# EAGLE design NSL_CylonIV (EAGLE 5.11)

## Sheet 1 of 4
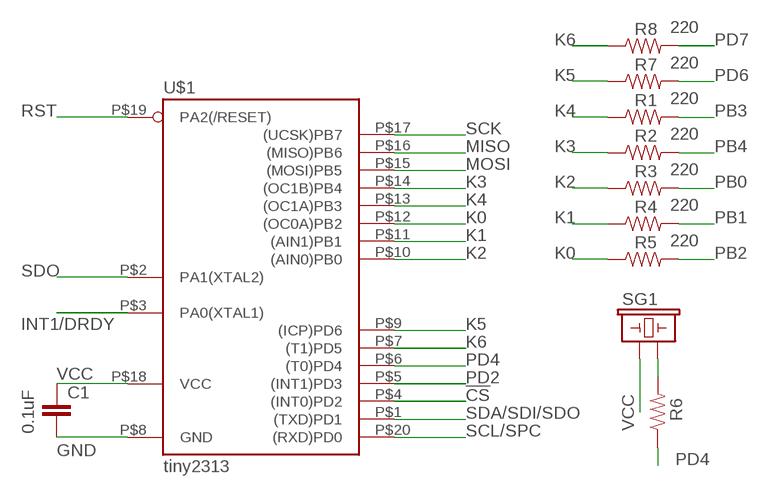
[diagram p0: schematic, sheet 1]

### Parts
C1  0.1uF  CAP0603-CAP  [0603-CAP]
R1  220  RESISTOR  [0805]
R2  220  RESISTOR  [0805]
R3  220  RESISTOR  [0805]
R4  220  RESISTOR  [0805]
R5  220  RESISTOR  [0805]
R6  RESISTOR1206  [1206]
R7  220  RESISTOR  [0805]
R8  220  RESISTOR  [0805]
SG1  BUZZERSMD2  [BUZZER-CCV]
U$1  tiny2313  TINY2313-*M*  [MLF20]

### Nets
!CS: U$1.P$4((INT0)PD2) ; also sheet 4
GND: C1.2 U$1.P$8(GND) ; also sheet 2,4
INT1/DRDY: U$1.P$3(PA0(XTAL1)) ; also sheet 4
K0 [LED]: R5.1 U$1.P$12((OC0A)PB2)
K1 [LED]: R4.1 U$1.P$11((AIN1)PB1)
K2 [LED]: R3.1 U$1.P$10((AIN0)PB0)
K3 [LED]: R2.1 U$1.P$14((OC1B)PB4)
K4 [LED]: R1.1 U$1.P$13((OC1A)PB3)
K5: R7.1 U$1.P$9((ICP)PD6)
K6: R8.1 U$1.P$7((T1)PD5)
MISO: U$1.P$16((MISO)PB6) ; also sheet 2
MOSI: U$1.P$15((MOSI)PB5) ; also sheet 2
N$4: R6.2 SG1.-
PB0: R3.2 ; also sheet 3
PB1: R4.2 ; also sheet 3
PB2 [LED]: R5.2 ; also sheet 3
PB3: R1.2 ; also sheet 3
PB4: R2.2 ; also sheet 3
PD2: U$1.P$5((INT1)PD3) ; also sheet 2
PD4: R6.1 U$1.P$6((T0)PD4)
PD6: R7.2 ; also sheet 3
PD7: R8.2 ; also sheet 3
RST: U$1.P$19(PA2(/RESET)) ; also sheet 2
SCK: U$1.P$17((UCSK)PB7) ; also sheet 2
SCL/SPC: U$1.P$20((RXD)PD0) ; also sheet 4
SDA/SDI/SDO: U$1.P$1((TXD)PD1) ; also sheet 4
SDO: U$1.P$2(PA1(XTAL2)) ; also sheet 4
VCC: C1.1 SG1.+ U$1.P$18(VCC) ; also sheet 2,4

## Sheet 2 of 4
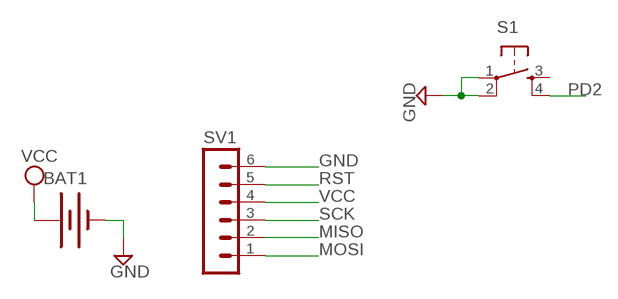
[diagram p1: schematic, sheet 2]

### Parts
BAT1  SPARKFUN_BATTERY245MM  [SPARKFUN_BATTCON_245MM]
S1  TAC_SWITCHSMD  [TACTILE_SWITCH_SMD]
SV1  MA06-1  [MA06-1]

### Nets
GND: BAT1.2(-) S1.1 S1.2 SV1.6 ; also sheet 1,4
MISO: SV1.2 ; also sheet 1
MOSI: SV1.1 ; also sheet 1
PD2: S1.4 ; also sheet 1
RST: SV1.5 ; also sheet 1
SCK: SV1.3 ; also sheet 1
VCC: BAT1.1(+) SV1.4 ; also sheet 1,4
Unconnected: S1.3

## Sheet 3 of 4
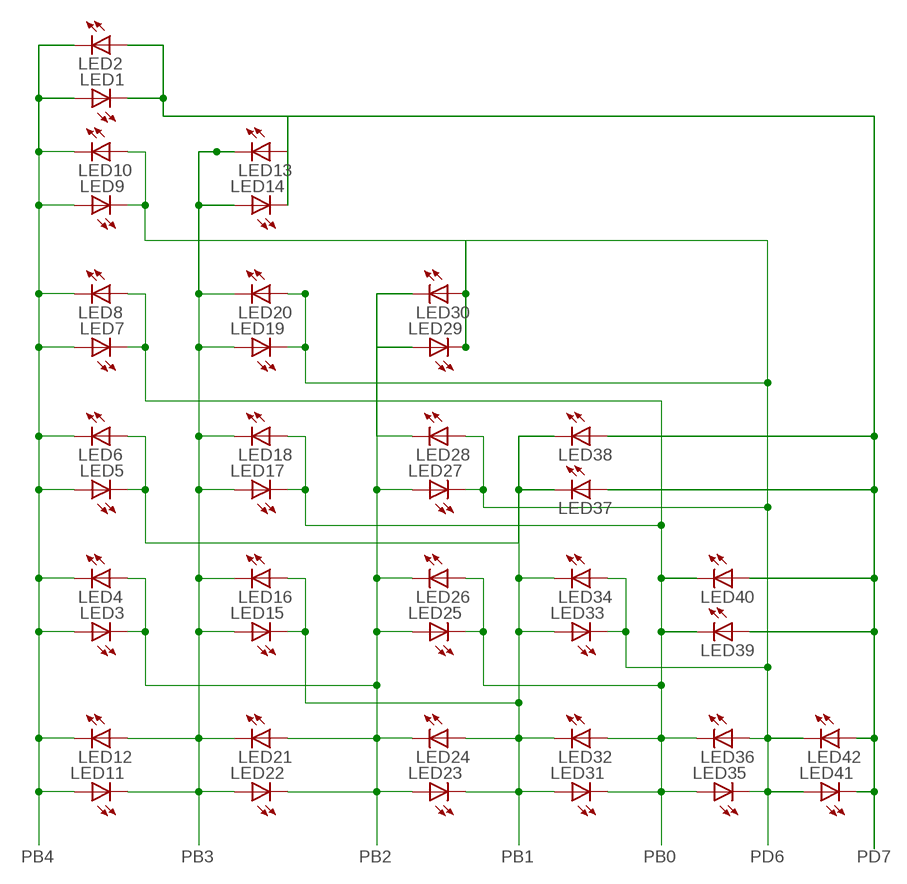
[diagram p2: schematic, sheet 3]

### Parts
LED1  LEDCHIPLED_1206  [CHIPLED_1206]
LED2  LEDCHIPLED_1206  [CHIPLED_1206]
LED3  LEDCHIPLED_1206  [CHIPLED_1206]
LED4  LEDCHIPLED_1206  [CHIPLED_1206]
LED5  LEDCHIPLED_1206  [CHIPLED_1206]
LED6  LEDCHIPLED_1206  [CHIPLED_1206]
LED7  LEDCHIPLED_1206  [CHIPLED_1206]
LED8  LEDCHIPLED_1206  [CHIPLED_1206]
LED9  LEDCHIPLED_1206  [CHIPLED_1206]
LED10  LEDCHIPLED_1206  [CHIPLED_1206]
LED11  LEDCHIPLED_1206  [CHIPLED_1206]
LED12  LEDCHIPLED_1206  [CHIPLED_1206]
LED13  LEDCHIPLED_1206  [CHIPLED_1206]
LED14  LEDCHIPLED_1206  [CHIPLED_1206]
LED15  LEDCHIPLED_1206  [CHIPLED_1206]
LED16  LEDCHIPLED_1206  [CHIPLED_1206]
LED17  LEDCHIPLED_1206  [CHIPLED_1206]
LED18  LEDCHIPLED_1206  [CHIPLED_1206]
LED19  LEDCHIPLED_1206  [CHIPLED_1206]
LED20  LEDCHIPLED_1206  [CHIPLED_1206]
LED21  LEDCHIPLED_1206  [CHIPLED_1206]
LED22  LEDCHIPLED_1206  [CHIPLED_1206]
LED23  LEDCHIPLED_1206  [CHIPLED_1206]
LED24  LEDCHIPLED_1206  [CHIPLED_1206]
LED25  LEDCHIPLED_1206  [CHIPLED_1206]
LED26  LEDCHIPLED_1206  [CHIPLED_1206]
LED27  LEDCHIPLED_1206  [CHIPLED_1206]
LED28  LEDCHIPLED_1206  [CHIPLED_1206]
LED29  LEDCHIPLED_1206  [CHIPLED_1206]
LED30  LEDCHIPLED_1206  [CHIPLED_1206]
LED31  LEDCHIPLED_1206  [CHIPLED_1206]
LED32  LEDCHIPLED_1206  [CHIPLED_1206]
LED33  LEDCHIPLED_1206  [CHIPLED_1206]
LED34  LEDCHIPLED_1206  [CHIPLED_1206]
LED35  LEDCHIPLED_1206  [CHIPLED_1206]
LED36  LEDCHIPLED_1206  [CHIPLED_1206]
LED37  LEDCHIPLED_1206  [CHIPLED_1206]
LED38  LEDCHIPLED_1206  [CHIPLED_1206]
LED39  LEDCHIPLED_1206  [CHIPLED_1206]
LED40  LEDCHIPLED_1206  [CHIPLED_1206]
LED41  LEDCHIPLED_1206  [CHIPLED_1206]
LED42  LEDCHIPLED_1206  [CHIPLED_1206]

### Nets
PB0: LED7.C LED8.A LED17.C LED18.A LED25.C LED26.A LED31.C LED32.A LED35.A LED36.C LED39.C LED40.C ; also sheet 1
PB1: LED5.C LED6.A LED15.C LED16.A LED23.C LED24.A LED31.A LED32.C LED33.A LED34.C LED37.C LED38.C ; also sheet 1
PB2 [LED]: LED3.C LED4.A LED21.A LED22.C LED23.A LED24.C LED25.A LED26.C LED27.A LED28.C LED29.A LED30.C ; also sheet 1
PB3: LED11.C LED12.A LED13.C LED14.A LED15.A LED16.C LED17.A LED18.C LED19.A LED20.C LED21.C LED22.A ; also sheet 1
PB4: LED1.A LED2.C LED3.A LED4.C LED5.A LED6.C LED7.A LED8.C LED9.A LED10.C LED11.A LED12.C ; also sheet 1
PD6: LED9.C LED10.A LED19.C LED20.A LED27.C LED28.A LED29.C LED30.A LED33.C LED34.A LED35.C LED36.A LED41.A LED42.C ; also sheet 1
PD7: LED1.C LED2.A LED13.A LED14.C LED37.A LED38.A LED39.A LED40.A LED41.C LED42.A ; also sheet 1

## Sheet 4 of 4
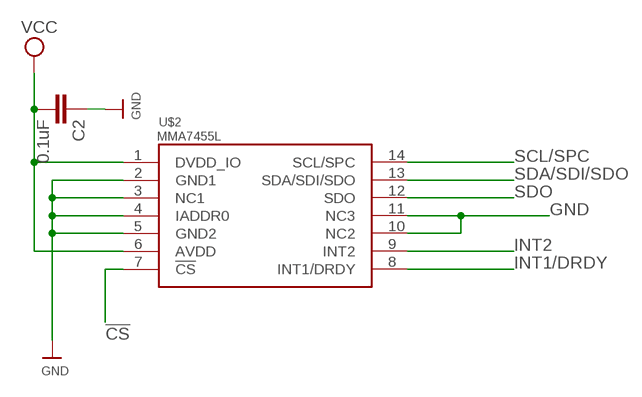
[diagram p3: schematic, sheet 4]

### Parts
C2  0.1uF  CAP0805  [0805]
U$2  MMA7455L  [LGA-14]

### Nets
!CS: U$2.7(!CS) ; also sheet 1
GND: C2.1 U$2.2(GND1) U$2.3(NC1) U$2.4(IADDR0) U$2.5(GND2) U$2.10(NC2) U$2.11(NC3) ; also sheet 1,2
INT1/DRDY: U$2.8(INT1/DRDY) ; also sheet 1
INT2: U$2.9(INT2)
SCL/SPC: U$2.14(SCL/SPC) ; also sheet 1
SDA/SDI/SDO: U$2.13(SDA/SDI/SDO) ; also sheet 1
SDO: U$2.12(SDO) ; also sheet 1
VCC: C2.2 U$2.1(DVDD_IO) U$2.6(AVDD) ; also sheet 1,2

## Library data of the parts
BAT1 = NSL:SPARKFUN_BATTERY: Battery Holders Various common sizes : AA, AAA, 20mm coin cell and 12mm coin cell.
C1 C2 = SparkFun:CAP: Capacitor Standard 0603 ceramic capacitor, and 0.1" leaded capacitor.
LED1-LED42 = led:LED: LED OSRAM: - CHIPLED LG R971, LG N971, LY N971, LG Q971, LY Q971, LO R971, LY R971 LH N974, LH R974 LS Q976, LO Q976, LY Q976 LO Q996 - Hyper CHIPLED LW Q18S LB Q993, LB Q99A, LB R99A - SideLED LS A670, LO A670, LY A670, LG A670, LP A670 LB A673, LV A673, LT A673, LW A673 LH A674 LY A675 LS A676, LA A676, LO A676, LY A676, LW A676 LS A679, LY A679, LG A679 - Hyper Micro SIDELED® LS Y876, LA Y876, LO Y876, LY Y876 LT Y87S - SmartLED LW L88C, LW L88S LB L89C, LB L89S, LG L890 LS L89K, LO L89K, LY L89K LS L896, LA L896, LO L896, LY L896 - TOPLED LS T670, LO T670, LY T670, LG T670, LP T670 LSG T670, LSP T670, LSY T670, LOP T670, LYG T670 LG T671, LOG T671, LSG T671 LB T673, LV T673, LT T673, LW T673 LH T674 LS T676, LA T676, LO T676, LY T676, LB T676, LH T676, LSB T676, LW T676 LB T67C, LV T67C, LT T67C, LS T67K, LO T67K, LY T67K, LW E67C LS E67B, LA E67B, LO E67B, LY E67B, LB E67C, LV E67C, LT E67C LW T67C LS T679, LY T679, LG T679 LS T770, LO T770, LY T770, LG T770, LP T770 LB T773, LV T773, LT T773, LW T773 LH T774 LS E675, LA E675, LY E675, LS T675 LS T776, LA T776, LO T776, LY T776, LB T776 LHGB T686 LT T68C, LB T68C - Hyper Mini TOPLED® LB M676 - Mini TOPLED Santana® LG M470 LS M47K, LO M47K, LY M47K Source: http://www.osram.convergy.de LUXEON: - LUMILED® LXK2-PW12-R00, LXK2-PW12-S00, LXK2-PW14-U00, LXK2-PW14-V00 LXK2-PM12-R00, LXK2-PM12-S00, LXK2-PM14-U00 LXK2-PE12-Q00, LXK2-PE12-R00, LXK2-PE12-S00, LXK2-PE14-T00, LXK2-PE14-U00 LXK2-PB12-K00, LXK2-PB12-L00, LXK2-PB12-M00, LXK2-PB14-N00, LXK2-PB14-P00, LXK2-PB14-Q00 LXK2-PR12-L00, LXK2-PR12-M00, LXK2-PR14-Q00, LXK2-PR14-R00 LXK2-PD12-Q00, LXK2-PD12-R00, LXK2-PD12-S00 LXK2-PH12-R00, LXK2-PH12-S00 LXK2-PL12-P00, LXK2-PL12-Q00, LXK2-PL12-R00 Source: www.luxeon.com KINGBRIGHT: KA-3528ASYC Source: www.kingbright.com
R1-R5 R7 R8 = NSL:RESISTOR: Resistor Basic schematic elements and footprints for 0603, 1206, and PTH 1/10th watt (small) resistors.
R6 = SparkFun:RESISTOR: Resistor Basic schematic elements and footprints for 0603, 1206, and PTH 1/10th watt (small) resistors.
S1 = SparkFun:TAC_SWITCH: Momentary Switch Button commonly used for reset or general input. Spark Fun Electronics SKU : COM-00097
SG1 = SparkFun:BUZZER: Buzzer 12mm Spark Fun Electronics SKU : Comp-Buzzer
SV1 = NSL:MA06-1: PIN HEADER
U$1 = NSL_Cylon:TINY2313*: Atmel Tiny2313 2K Flash, 128 bytes EEPROM, 128 bytes RAM
U$2 = MMA7455Lbreakoutboard-v1a:MMA7455L

## Net classes
0 default: width 0.254 mm
1 LED: width 0.203 mm

## Board
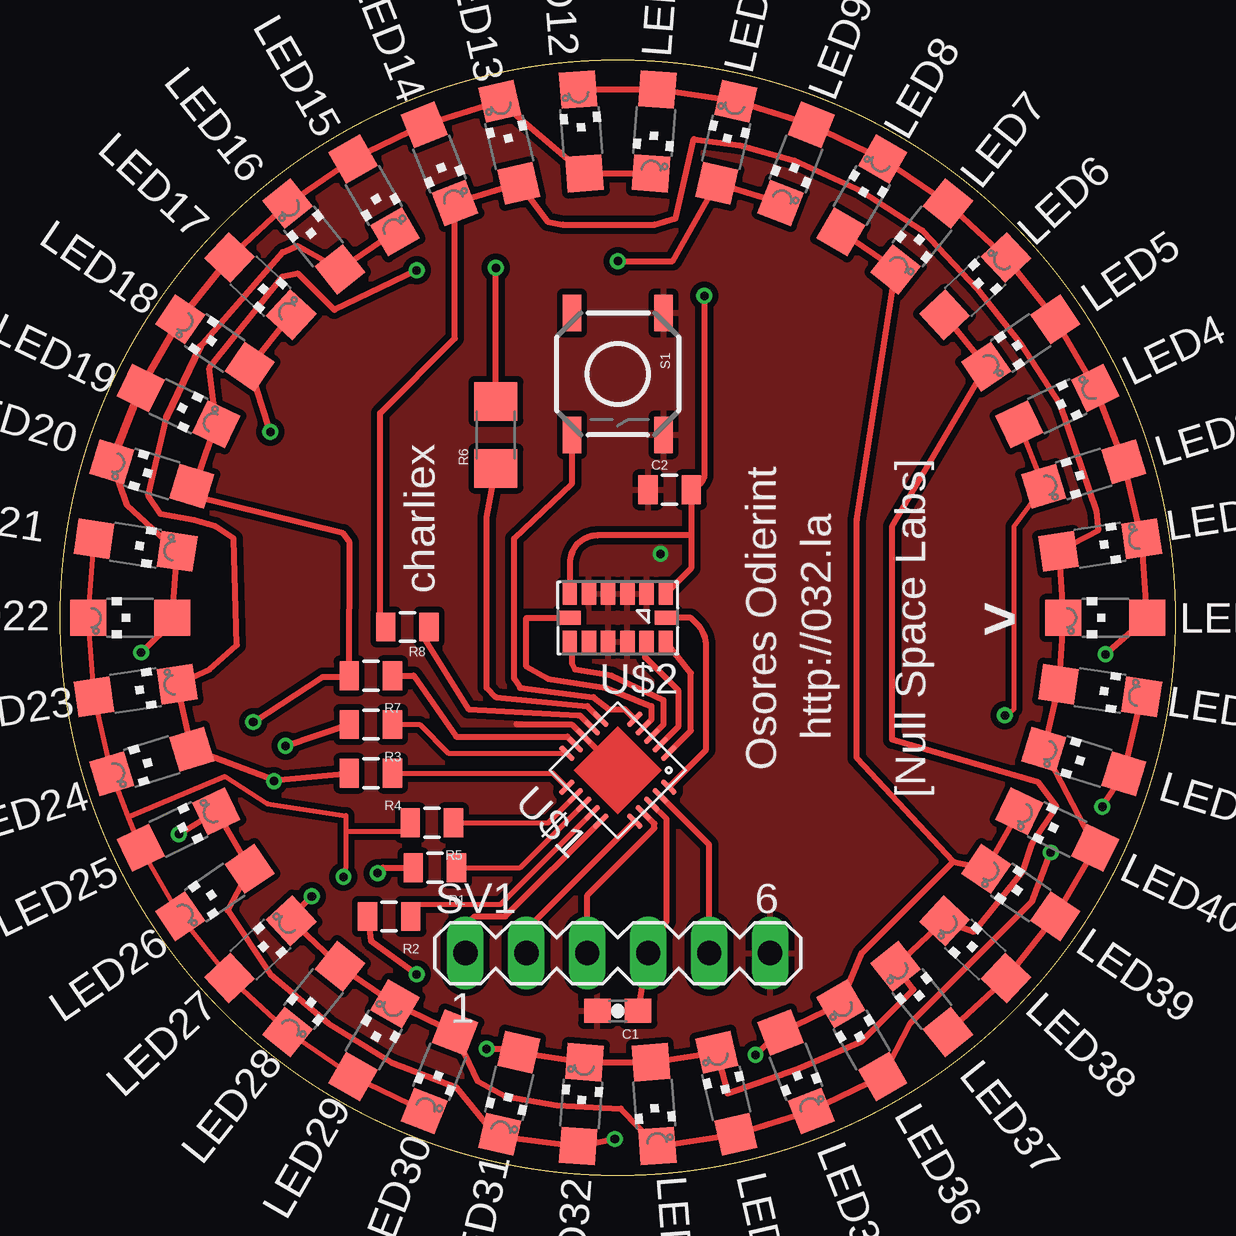
[diagram p4: board, top side]
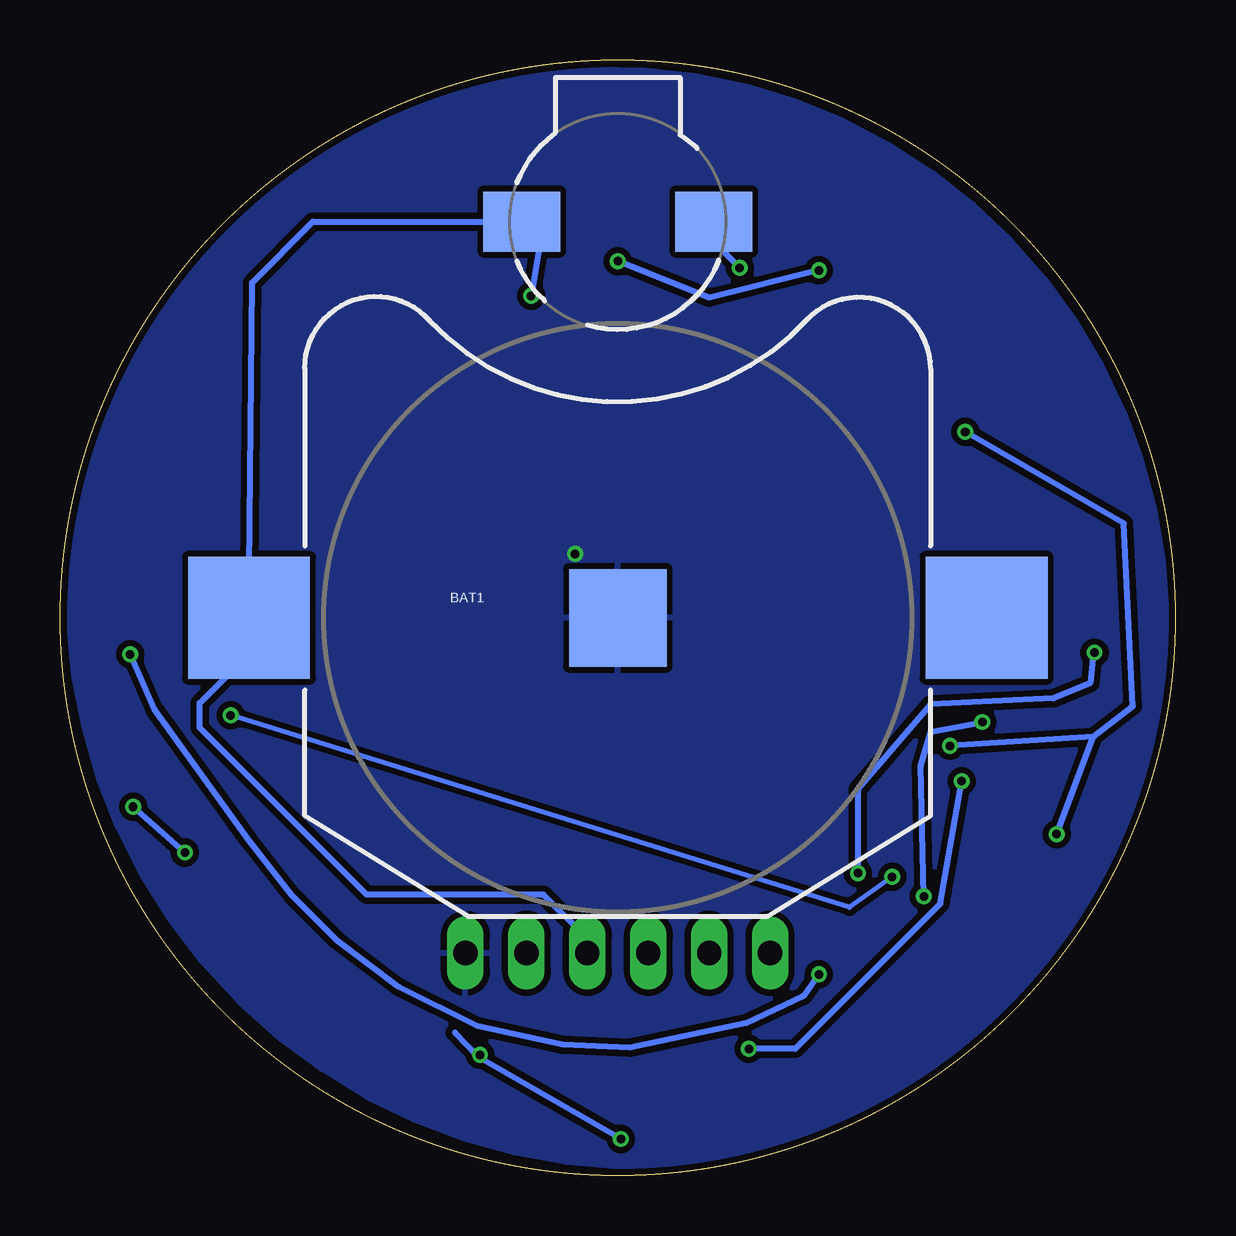
[diagram p5: board, bottom side, seen from below]

Size 46.48 x 46.48 mm. Coordinates in mm from the lower left corner, seen from the top.
Outline: circle at 23.24,23.24 radius 23.24
Copper layers (1*16): Top 0.035mm / dielectric 1.5mm / Bottom 0.035mm
Design rules "ITead_rule": minimum track width 6mil, minimum drill 12mil, track to track 6mil, track to pad 6mil, pad to pad 6mil, via to via 6mil, smd to smd 0mil, copper to edge 10mil, drill to drill 10mil, minimum pad ring 10mil, minimum via ring 6mil, stop-mask expansion 2mil, vias tented up to drill 100mil, thermal gap 10mil
vRestrict: area 10.3,10.8 to 36.3,36.6

### Footprints (pad centres in the part's own frame; a part is rotated, then mirrored left to right if it is on the bottom)
SPARKFUN_BATTCON_245MM = smd 5.08 x 5.08: 1 -15.367,0; 3 15.367,0 | smd 4.064 x 4.064: 2 0,0
0603-CAP = smd 1.1 x 1: 1 -0.85,0; 2 0.85,0
0805 = smd 0.8 x 1.2: 1 -0.9,0; 2 0.9,0
CHIPLED_1206 = smd 1.5 x 1.5: A 0,-1.75; C 0,1.75
1206 = smd 1.6 x 1.8: 1 -1.4,0; 2 1.4,0
TACTILE_SWITCH_SMD = smd 1.524 x 0.762: 1 -2.54,1.905; 2 2.54,1.905; 3 -2.54,-1.905; 4 2.54,-1.905
BUZZER-CCV = smd 3.2 x 2.5: + 4,0; - -4,0
MA06-1 = drill 1.016 long: 1 -6.35,0; 2 -3.81,0; 3 -1.27,0; 4 1.27,0; 5 3.81,0; 6 6.35,0
MLF20 = smd 0.8 x 0.23: P$1 -2,1; P$2 -2,0.5; P$3 -2,0; P$4 -2,-0.5; P$5 -2,-1; P$11 2,-1; P$12 2,-0.5; P$13 2,0; P$14 2,0.5; P$15 2,1 | smd 0.23 x 0.8: P$6 -1,-2; P$7 -0.5,-2; P$8 0,-2; P$9 0.5,-2; P$10 1,-2; P$16 1,2; P$17 0.5,2; P$18 0,2; P$19 -0.5,2; P$20 -1,2
LGA-14 = smd 0.6 x 0.9: 1 -2,-1; 2 -1.2,-1; 3 -0.4,-1; 4 0.4,-1; 5 1.2,-1; 6 2,-1; 8 2,1; 9 1.2,1; 10 0.4,1; 11 -0.4,1; 12 -1.2,1; 13 -2,1 | smd 0.9 x 0.6: 7 2,0; 14 -2,0

### Placement (x,y rotation side)
BAT1  23.24,23.24 0 bottom
C1  23.24,6.86 180 top
C2  25.4,28.58 0 top
LED1  43.56,23.24 90 top
LED2  43.33,26.27 278.6 top
LED3  42.66,29.23 107.1 top
LED4  41.55,32.06 295.7 top
LED5  40.03,34.69 124.3 top
LED6  38.14,37.06 312.9 top
LED7  35.91,39.13 141.4 top
LED8  33.4,40.84 330 top
LED9  30.67,42.16 158.6 top
LED10  27.76,43.05 347.1 top
LED11  24.76,43.51 175.7 top
LED12  21.72,43.51 4.3 top
LED13  18.72,43.05 12.9 top
LED14  15.82,42.16 201.4 top
LED15  13.08,40.84 210 top
LED16  10.57,39.13 38.6 top
LED17  8.35,37.06 227.1 top
LED18  6.45,34.69 55.7 top
LED19  4.93,32.06 244.3 top
LED20  3.82,29.23 72.9 top
LED21  3.15,26.27 261.4 top
LED22  2.92,23.24 90 top
LED23  3.15,20.21 278.6 top
LED24  3.82,17.25 107.1 top
LED25  4.93,14.42 295.7 top
LED26  6.45,11.79 124.3 top
LED27  8.35,9.42 312.9 top
LED28  10.57,7.35 141.4 top
LED29  13.08,5.64 330 top
LED30  15.82,4.33 158.6 top
LED31  18.72,3.43 167.1 top
LED32  21.72,2.98 355.7 top
LED33  24.76,2.98 184.3 top
LED34  27.76,3.43 12.9 top
LED35  30.67,4.33 201.4 top
LED36  33.4,5.64 30 top
LED37  35.91,7.35 38.6 top
LED38  38.14,9.42 47.1 top
LED39  40.03,11.79 55.7 top
LED40  41.55,14.42 64.3 top
LED41  42.66,17.25 72.9 top
LED42  43.33,20.21 261.4 top
R1  15.62,12.83 180 top
R2  13.72,10.8 180 top
R3  12.95,18.8 180 top
R4  12.95,16.76 180 top
R5  15.49,14.7 180 top
R6  18.16,30.86 90 top
R7  12.95,20.83 180 top
R8  14.48,22.86 180 top
S1  23.24,33.4 270 top
SG1  23.24,39.75 180 bottom
SV1  23.24,9.27 0 top
U$1  23.24,16.89 225 top
U$2  23.24,23.24 180 top

### Tracks (layer width: path | path; a pad name or v marks a point on that pad's centre or on a via)
!CS
  Top 0.254: U$2.7 19.43,23.24 19.43,21.21 20.32,20.7 22.73,20.32 24.64,19.56 24.64,19 U$1.P$4
GND  (via drill 0.36)
  Top 0.254: 21.35,18.78 U$1.P$8 23.24,16.89 | 19.05,18.8 21.35,18.78 | 21.35,18.78 19.05,18.79 19.05,18.8 | 19.05,18.8 19.02,18.81
  other vias: 25.02,25.91
  pour Top (isolate 0.254): 46.1,23.02 arc90 24.29,46.1 arc90 0.38,23.46 arc90 20.92,0.38 arc90
  pour Bottom (isolate 0.254): 46.1,23.02 arc90 24.29,46.1 arc90 0.38,23.46 arc90 20.92,0.38 arc90
INT1/DRDY
  Top 0.254: U$2.8 21.34,22.15 21.34,21.34 21.46,21.08 22.99,20.83 25.15,19.81 25.15,18.8 U$1.P$3
K0
  Top 0.203: U$1.P$12 20.34,14.7 R5.1
K1
  Top 0.203: U$1.P$11 20.54,16.76 R4.1
K2
  Top 0.203: R3.1 14.99,18.8 16.18,17.6 U$1.P$10
K3
  Top 0.203: U$1.P$14 18.36,11.3 14.73,11.3 14.62,11.19 R2.1
K4
  Top 0.203: U$1.P$13 19.18,12.83 R1.1
K5
  Top 0.254: U$1.P$9 21.14,18.29 16.51,18.29 14.73,20.83 R7.1
K6
  Top 0.254: R8.1 15.11,22.85 15.11,22.48 17.02,19.43 21.59,19.18 21.66,19.18 U$1.P$7
MISO
  Top 0.254: SV1.2 19.43,10.25 U$1.P$16
MOSI
  Top 0.254: U$1.P$15 18.56,10.8 17.27,10.8 16.89,10.41 SV1.1
N$4  (via drill 0.36)
  Top 0.254: R6.2 v18.16,37.82
  Bottom 0.254: v18.16,37.82 19.18,38.84 19.18,39.65 SG1.-
PB0  (via drill 0.36)
  Top 0.254: 18.16,1.65 LED32.A v23.11,1.52 | 18.16,1.65 LED31.C | LED40.C LED39.C 37.21,13.08 | LED8.A LED7.C 33.2,27.3 33.2,17.39 37.21,13.08 | LED17.C LED18.A v8.76,30.99 | 18.16,1.65 16.51,3.68 13.84,4.7 11.18,6.35 8.76,8.38 6.98,11.05 LED26.A LED25.C v4.95,14.22 | 37.21,13.08 33.4,9.27 LED36.C LED35.A 29.9,5.94 v28.98,5.03 | v9.4,17.91 R3.2
  Bottom 0.254: v23.11,1.52 29.04,4.93 | 29.04,4.93 29.08,4.95 LED35.A | 3.43,18.29 1.78,19.56 2.16,27.18 v8.76,30.99 | 3.43,18.29 v9.4,17.91 | v4.95,14.22 3.43,18.29 | 29.04,4.93 v28.98,5.03
PB1  (via drill 0.36)
  Top 0.254: LED15.C LED16.A 9.91,38.74 9.27,38.48 5.84,34.54 | 8.93,16.47 LED24.A LED23.C 6.22,21.08 7.37,22.1 7.24,26.54 6.48,27.05 5.59,27.3 4.19,27.56 3.68,28.32 4.45,31.62 | 8.93,16.47 R4.2 | LED6.A LED5.C 34.67,27.05 34.67,18.16 40.77,16.38 41.53,15.37 40.51,13.84 40.13,12.7 38.1,10.16 LED38.C LED37.C 35.56,7.75 33.4,5.59 30.73,4.45 27.81,3.43 LED34.C LED33.A LED32.C LED31.A 19,5.21 18.92,5.28 v17.78,5.28 | v8.91,16.43 8.91,16.48 8.93,16.47
  Top 0.305: 4.45,31.62 5.84,34.54
  Bottom 0.254: v8.91,16.43 9.8,11.33 15.85,5.28 v17.78,5.28
PB2  (via drill 0.36)
  Top 0.203: LED30.C LED29.A LED28.C LED27.A LED26.C LED25.A 2.85,14.96 | 2.85,14.96 LED24.C LED23.A LED22.C LED21.A | LED4.A LED3.C 39.75,27.05 39.75,19.43 v39.37,19.18 | 2.85,14.96 6.86,16.64 8.64,15.49 11.91,15 11.91,14.35 | v11.81,12.45 11.91,12.86 11.91,14.35 | R5.2 14.25,14.35 11.91,14.35
  Bottom 0.203: v39.37,19.18 13.59,11.18 v11.81,12.45
PB3  (via drill 0.36)
  Top 0.254: LED20.C 2.79,27.94 LED21.C LED22.A 4.77,23.16 v3.38,21.79 | LED17.A LED16.C LED15.A LED14.A LED13.C LED12.A LED11.C | v13.23,12.6 13.46,12.83 R1.2
  Top 0.305: LED20.C LED19.A LED18.C LED17.A
  Bottom 0.254: v13.23,12.6 13.23,16.1 10.21,19.63 5.08,19.89 3.56,20.52 3.43,21.74 v3.38,21.79
PB4  (via drill 0.36)
  Top 0.254: R2.2 12.95,9.78 v14.86,8.38 | v43.56,21.72 LED1.A LED2.C LED3.A LED4.C LED5.A LED6.C LED7.A LED8.C LED9.A LED10.C LED11.A LED12.C
  Bottom 0.254: v14.86,8.38 15.49,7.49 17.91,6.35 22.73,5.33 25.53,5.46 29.08,6.22 32.38,7.87 34.92,9.78 36.83,11.68 38.61,13.97 42.55,19.43 v43.56,21.72
PD2
  Top 0.254: S1.4 21.34,28.83 18.92,26.54 18.92,20.7 19.18,20.32 22.22,19.94 22.86,19.43 23.53,19.43 U$1.P$5
PD4
  Top 0.254: R6.1 17.78,27.43 17.78,20.32 18.16,19.94 21.97,19.56 22.52,19.01 U$1.P$6
PD6  (via drill 0.36)
  Top 0.254: LED42.C LED41.A v43.43,15.37 | LED10.A 27.05,41.02 | LED10.A LED9.C | 5.46,28.32 LED19.C 6.22,33.65 9.27,37.46 9.91,37.59 11.43,36.07 v14.86,37.72 | 5.46,28.32 LED20.A | v41.27,13.46 40.51,11.43 35.43,6.35 LED36.A LED35.C LED34.A LED33.C 23.37,2.79 20.7,2.92 18.54,3.3 17.4,3.94 LED30.A LED29.C LED28.A LED27.C 9.58,10.72 v10.49,11.63 | 5.46,28.32 11.8,26.76 12.06,26.38 R7.2 11.94,20.78 10.95,20.78 v8.05,18.9 | LED10.A 25.53,38.1 v23.24,38.1
  Bottom 0.254: v41.27,13.46 v43.43,15.37 | v23.24,38.1 19.43,36.58 v14.86,37.72 | v8.05,18.9 10.21,18.49 10.62,17.07 v10.49,11.63
PD7
  Top 0.254: LED37.A LED38.A LED39.A LED40.A LED41.C LED42.A LED1.C LED2.A 43.26,26.87 43.18,27.69 41.66,32.13 40,34.67 38.23,36.96 35.94,39.37 33.4,41.02 30.61,42.29 28.32,42.93 26.42,43.18 25.65,39.88 24.77,39.62 20.95,39.62 20.32,39.75 LED13.A LED14.C 16.45,34.88 13.33,31.77 13.33,22.87 R8.2
RST
  Top 0.254: U$1.P$19 25.78,15.06 27.05,13.79 SV1.5
SCK
  Top 0.254: U$1.P$17 24.77,14.66 24.77,14.48 21.97,11.68 SV1.3
SCL/SPC
  Top 0.254: U$1.P$20 26.92,17.75 26.92,22.06 arc45 26.54,22.99 26.29,23.24 U$2.14
SDA/SDI/SDO
  Top 0.254: U$1.P$1 25.36,17.62 26.29,18.54 26.29,20.94 U$2.13
SDO
  Top 0.254: U$1.P$2 25.78,18.72 25.78,20.19 24.38,21.59 24.38,22.18 U$2.12
VCC  (via drill 0.36)
  Top 0.254: C1.1 SV1.4 25.27,10.59 25.27,14.86 U$1.P$18 | 26.3,26.67 C2.2 26.34,28.68 arc84 26.85,29.24 v26.85,36.65 | 26.3,26.67 26.3,25.3 U$2.1 | 26.3,26.67 22.39,26.67 arc90 21.24,25.52 U$2.6
  Bottom 0.254: SG1.+ 28.32,39.75 | SG1.+ 35.94,39.75 38.48,37.21 BAT1.1 38.68,23.14 38.68,21.67 40.66,19.69 40.66,18.67 33.71,11.71 26.34,11.71 24.51,9.88 SV1.4 | v26.85,36.65 26.47,38.94 27.18,39.65 SG1.+

### Text on the board
tPlace: charliex | > | http://032.la | Osores Odierint | [Null Space Labs]